# Altium schematic sheet Sensores.SchDoc
size A4
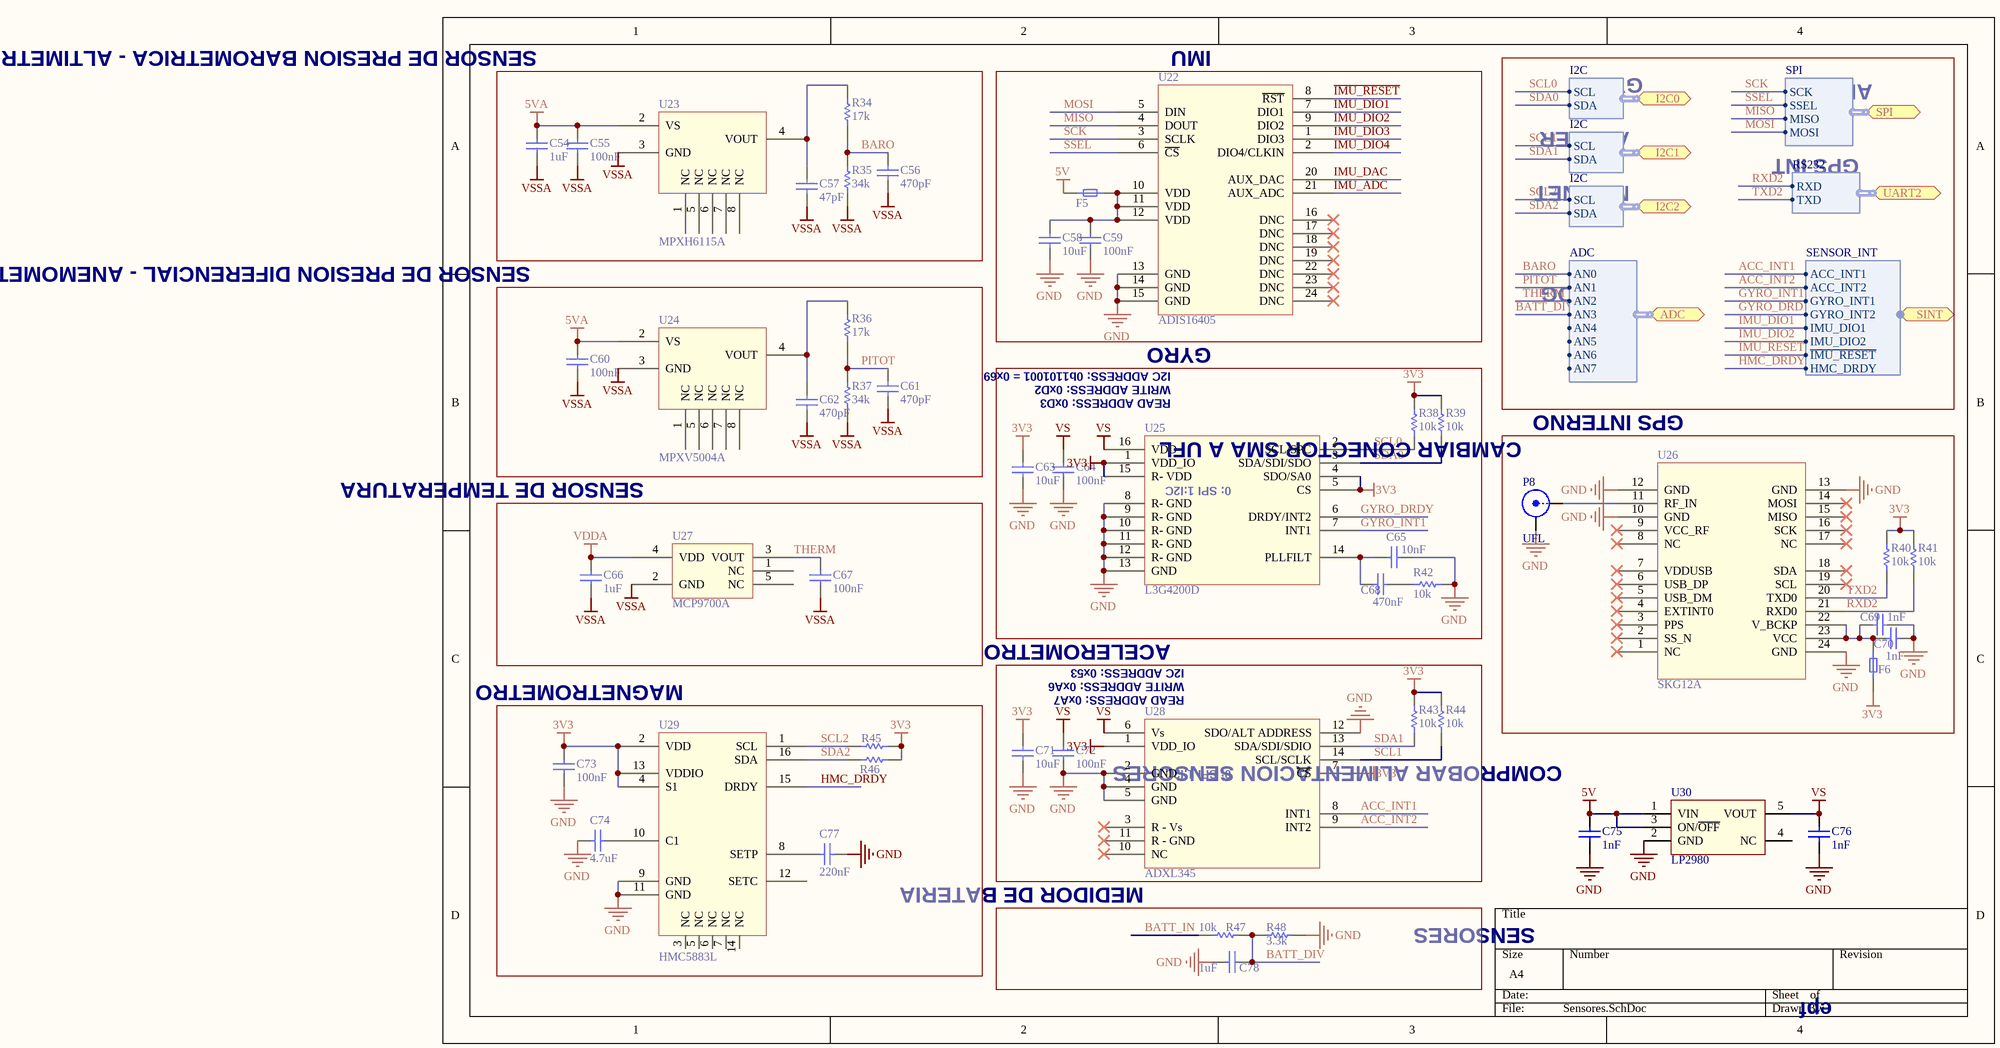
[diagram p0: Sensores.SchDoc]

## Parts
C54  value 1uF  [CAP0402]  (hidden comment: Capacitor)
C55  value 100nF  [CAP0402]  (hidden comment: Capacitor)
C56  value 470pF  [CAP0402]  (hidden comment: Capacitor)
C57  value 47pF  [CAP0402]  (hidden comment: Capacitor)
C58  value 10uF  [CAP0402]  (hidden comment: Capacitor)
C59  value 100nF  [CAP0402]  (hidden comment: Capacitor)
C60  value 100nF  [CAP0402]  (hidden comment: Capacitor)
C61  value 470pF  [CAP0402]  (hidden comment: Capacitor)
C62  value 470pF  [CAP0402]  (hidden comment: Capacitor)
C63  value 10uF  [CAP0402]  (hidden comment: Capacitor)
C64  value 100nF  [CAP0402]  (hidden comment: Capacitor)
C65  value 10nF  [CAP0402]  (hidden comment: Capacitor)
C66  value 1uF  [CAP0402]  (hidden comment: Capacitor)
C67  value 100nF  [CAP0402]  (hidden comment: Capacitor)
C68  value 470nF  [CAP0402]  (hidden comment: Capacitor)
C69  value 1nF  [CAP0402]  (hidden comment: Capacitor)
C70  value 1nF  [CAP0402]  (hidden comment: Capacitor)
C71  value 10uF  [CAP0402]  (hidden comment: Capacitor)
C72  value 100nF  [CAP0402]  (hidden comment: Capacitor)
C73  value 100nF  [CAP0402]  (hidden comment: Capacitor)
C74  value 4.7uF  [CAP0402]  (hidden comment: Capacitor)
C75  value 1nF  [CAP0402]  (hidden comment: Capacitor)
C76  value 1nF  [CAP0402]  (hidden comment: Capacitor)
C77  value 220nF  [CAP0402]  (hidden comment: Capacitor)
C78  value 1uF  [CAP0402]  (hidden comment: Capacitor)
F5  Ferrita  [IND0603]  (value not drawn)
F6  Ferrita  [IND0603]  (value not drawn)
P8  UFL  [UFL]
R34  value 17k  [RES0402]  (hidden comment: Resistor)
R35  value 34k  [RES0402]  (hidden comment: Resistor)
R36  value 17k  [RES0402]  (hidden comment: Resistor)
R37  value 34k  [RES0402]  (hidden comment: Resistor)
R38  value 10k  [RES0402]  (hidden comment: Resistor)
R39  value 10k  [RES0402]  (hidden comment: Resistor)
R40  value 10k  [RES0402]  (hidden comment: Resistor)
R41  value 10k  [RES0402]  (hidden comment: Resistor)
R42  value 10k  [RES0402]  (hidden comment: Resistor)
R43  value 10k  [RES0402]  (hidden comment: Resistor)
R44  value 10k  [RES0402]  (hidden comment: Resistor)
R45  Resistor  [RES0402]  (value not drawn)
R46  Resistor  [RES0402]  (value not drawn)
R47  value 10k  [RES0402]  (hidden comment: Resistor)
R48  value 3.3k  [RES0402]  (hidden comment: Resistor)
U22  ADIS16405  [ADIS16405]
U23  MPXH6115A  [SSOP1317]
U24  MPXV5004A  [SSOP1351 - MPXV5004DP]
U25  L3G4200D  [QFN65P400X400-16 - L3G4200D]
U26  SKG12A  [SKG12A]
U27  MCP9700A  [SOT353-5AN]
U28  ADXL345  [LGA80P500X300-14N]
U29  HMC5883L  [QFN50P300X300-16-HMC]
U30  LP2980  [SOT23-5BN]

## Blocks framed on the sheet
SENSOR DE PRESION DIFERENCIAL - ANEMOMETRO: C54-C57 R34 R35 U23
GYRO: C58 C59 F5 U22
SENSOR DE TEMPERATURA: C60-C62 R36 R37 U24
ACELEROMETRO: C63-C65 C68 R38 R39 R42 U25
CAMBIAR CONECTOR SMA A UFL: C69 C70 F6 P8 R40 R41 U26
MEDIDOR DE BATERIA: C71 C72 R43 R44 U28

## Ports
ADC (harness ADC), I2C0 (harness I2C), I2C1 (harness I2C), I2C2 (harness I2C), SINT (harness SENSOR_INT), SPI (harness SPI), UART2 (harness RS232)

## Harnesses
I2C: SCL, SDA
ADC: AN0, AN1, AN2, AN3, AN4, AN5, AN6, AN7
RS232: RXD, TXD
SPI: SCK, SSEL, MISO, MOSI
SENSOR_INT: ACC_INT1, ACC_INT2, GYRO_INT1, GYRO_INT2, IMU_DIO1, IMU_DIO2, ~{IMU_RESET}, HMC_DRDY

## Nets
3V3: C63.2 C71.2 C73.1 F6.1 R38.1 R39.1 R40.1 R41.1 R43.1 R44.1 R45.2 R46.2 U25.1(VDD_IO) U25.4(SDO/SA0) U25.5(CS) U25.15(R-_VDD) U28.1(VDD_IO) U28.7(~{CS}) U29.2(VDD) U29.4(S1) U29.13(VDDIO)
5V: C75.2 F5.1 U30.1(VIN) U30.3(ON/~{OFF})
5VA: C54.2 C55.2 C60.2 U23.2(VS) U24.2(VS)
GND: C58.1 C59.1 C63.1 C64.1 C65.1 C69.1 C70.1 C71.1 C72.1 C73.2 C74.2 C75.1 C76.1 C77.1 C78.1 P8.2(Y) R42.2 R48.2 U22.13(GND) U22.14(GND) U22.15(GND) U25.8(R-_GND) U25.9(R-_GND) U25.10(R-_GND) U25.11(R-_GND) U25.12(R-_GND) U25.13(GND) U26.10(GND) U26.12(GND) U26.13(GND) U26.24(GND) U28.2(GND) U28.4(GND) U28.5(GND) U28.12(SDO/ALT_ADDRESS) U29.9(GND) U29.11(GND) U30.2(GND)
VDDA: C66.2 U27.4(VDD)
VS: C64.2 C72.2 C76.2 U25.16(VDD) U28.6(Vs) U30.5(VOUT)
VSSA: C54.1 C55.1 C56.1 C57.1 C60.1 C61.1 C62.1 C66.1 C67.1 R35.2 R37.2 U23.3(GND) U24.3(GND) U27.2(GND)
~{IMU_RESET}: U22.8(~{RST}) ; port SINT.~{IMU_RESET}
ACC_INT1: U28.8(INT1) ; port SINT.ACC_INT1
ACC_INT2: U28.9(INT2) ; port SINT.ACC_INT2
BARO: C56.2 R34.2 R35.1 ; port ADC.AN0
BATT_DIV: C78.2 R47.2 R48.1 ; port ADC.AN3
BATT_IN: R47.1
GYRO_DRDY: U25.6(DRDY/INT2) ; port SINT.GYRO_INT2
GYRO_INT1: U25.7(INT1) ; port SINT.GYRO_INT1
HMC_DRDY: U29.15(DRDY) ; port SINT.HMC_DRDY
IMU_ADC: U22.21(AUX_ADC)
IMU_DAC: U22.20(AUX_DAC)
IMU_DIO1: U22.7(DIO1) ; port SINT.IMU_DIO1
IMU_DIO2: U22.9(DIO2) ; port SINT.IMU_DIO2
IMU_DIO3: U22.1(DIO3)
IMU_DIO4: U22.2(DIO4/CLKIN)
MISO: U22.4(DOUT) ; port SPI.MISO
MOSI: U22.5(DIN) ; port SPI.MOSI
PITOT: C61.2 R36.2 R37.1 ; port ADC.AN1
RXD2: R41.2 U26.21(RXD0) ; port UART2.RXD
SCK: U22.3(SCLK) ; port SPI.SCK
SCL0: R38.2 U25.2(SCL/SPC) ; port I2C0.SCL
SCL1: R44.2 U28.14(SCL/SCLK) ; port I2C1.SCL
SCL2: R45.1 U29.1(SCL) ; port I2C2.SCL
SDA0: R39.2 U25.3(SDA/SDI/SDO) ; port I2C0.SDA
SDA1: R43.2 U28.13(SDA/SDI/SDIO) ; port I2C1.SDA
SDA2: R46.1 U29.16(SDA) ; port I2C2.SDA
SSEL: U22.6(~{CS}) ; port SPI.SSEL
THERM: C67.2 U27.3(VOUT) ; port ADC.AN2
TXD2: R40.2 U26.20(TXD0) ; port UART2.TXD
NetC57_2: C57.2 R34.1 U23.4(VOUT)
NetC58_2: C58.2 C59.2 F5.2 U22.10(VDD) U22.11(VDD) U22.12(VDD)
NetC62_2: C62.2 R36.1 U24.4(VOUT)
NetC65_2: C65.2 C68.2 U25.14(PLLFILT)
NetC68_1: C68.1 R42.1
NetC69_2: C69.2 C70.2 F6.2 U26.22(V_BCKP) U26.23(VCC)
NetC74_1: C74.1 U29.10(C1)
NetC77_2: C77.2 U29.8(SETP)
NetP8_1: P8.1(X) U26.11(RF_IN)

Not connected (* = marked no-connect by the designer): U22 16(DNC)* 17(DNC)* 18(DNC)* 19(DNC)* 22(DNC)* 23(DNC)* 24(DNC)*; U23 1(NC) 5(NC) 6(NC) 7(NC) 8(NC); U24 1(NC) 5(NC) 6(NC) 7(NC) 8(NC); U26 1(NC)* 2(SS_N)* 3(PPS)* 4(EXTINT0)* 5(USB_DM)* 6(USB_DP)* 7(VDDUSB)* 8(NC)* 9(VCC_RF)* 14(MOSI)* 15(MISO)* 16(SCK)* 17(NC)* 18(SDA)* 19(SCL)*; U27 1(NC) 5(NC); U28 3(R_-_Vs)* 10(NC)* 11(R_-_GND)*; U29 3(NC) 5(NC) 6(NC) 7(NC) 12(SETC) 14(NC); U30 4(NC)

## Notes on the sheet
- (near R34) SENSOR DE PRESION BAROMETRICA - ALTIMETRO
- (near U22) IMU
- ACELER
- GYRO
- ADIS
- MAGNET
- GPS INT
- ANALOG
- I2C ADDRESS: 0b1101001 = 0x69
- (near U25) READ ADDRESS: 0xD3
- WRITE ADDRESS: 0xD2
- GPS INTERNO
- I2C ADDRESS: 0x53
- MAGNETROMETRO
- (near U28) WRITE ADDRESS: 0xA6
- (near U28) READ ADDRESS: 0xA7
- COMPROBAR ALIMENTACION SENSORES
- SENSORES
- epf
- (in symbol ADXL345) 0: SPI 1:I2C
- (in symbol L3G4200D) 0: SPI 1:I2C

## Library data of the parts
C54-C78 = Cap
R34-R44 R47 R48 = Res
R45 R46 = Res: Value: 2.2k
U23 = MPXH6115A: ABSOLUTE PRESSURE SENSOR
U24 = MPXV5004A: Differential Pressure Sensor
U25 = L3G4200D: 3 axis gyroscope
U26 = SKG12A: MODULO GPS DE SkyNav
U27 = MCP9700A: SENSOR DE TEMPERATURA
U28 = ADXL345: Digital Accelerometer
U30 = LP2980: Current 50mA